# Altium schematic sheet CLK_DISTRO.SchDoc: Clock Generator, 500kHz, 4 Phase
size Letter; Organization: ORGANIZATION; Address1: ADDRESS 1; Address2: ADDRESS 2; Address3: ADDRESS 3; Address4: ADDRESS 4; Revision: -; SheetNumber: 1; SheetTotal: 1; ENG_APP_DATE: --/--/--; DSN_APP_DATE: --/--/--; CHK_APP_DATE: --/--/--
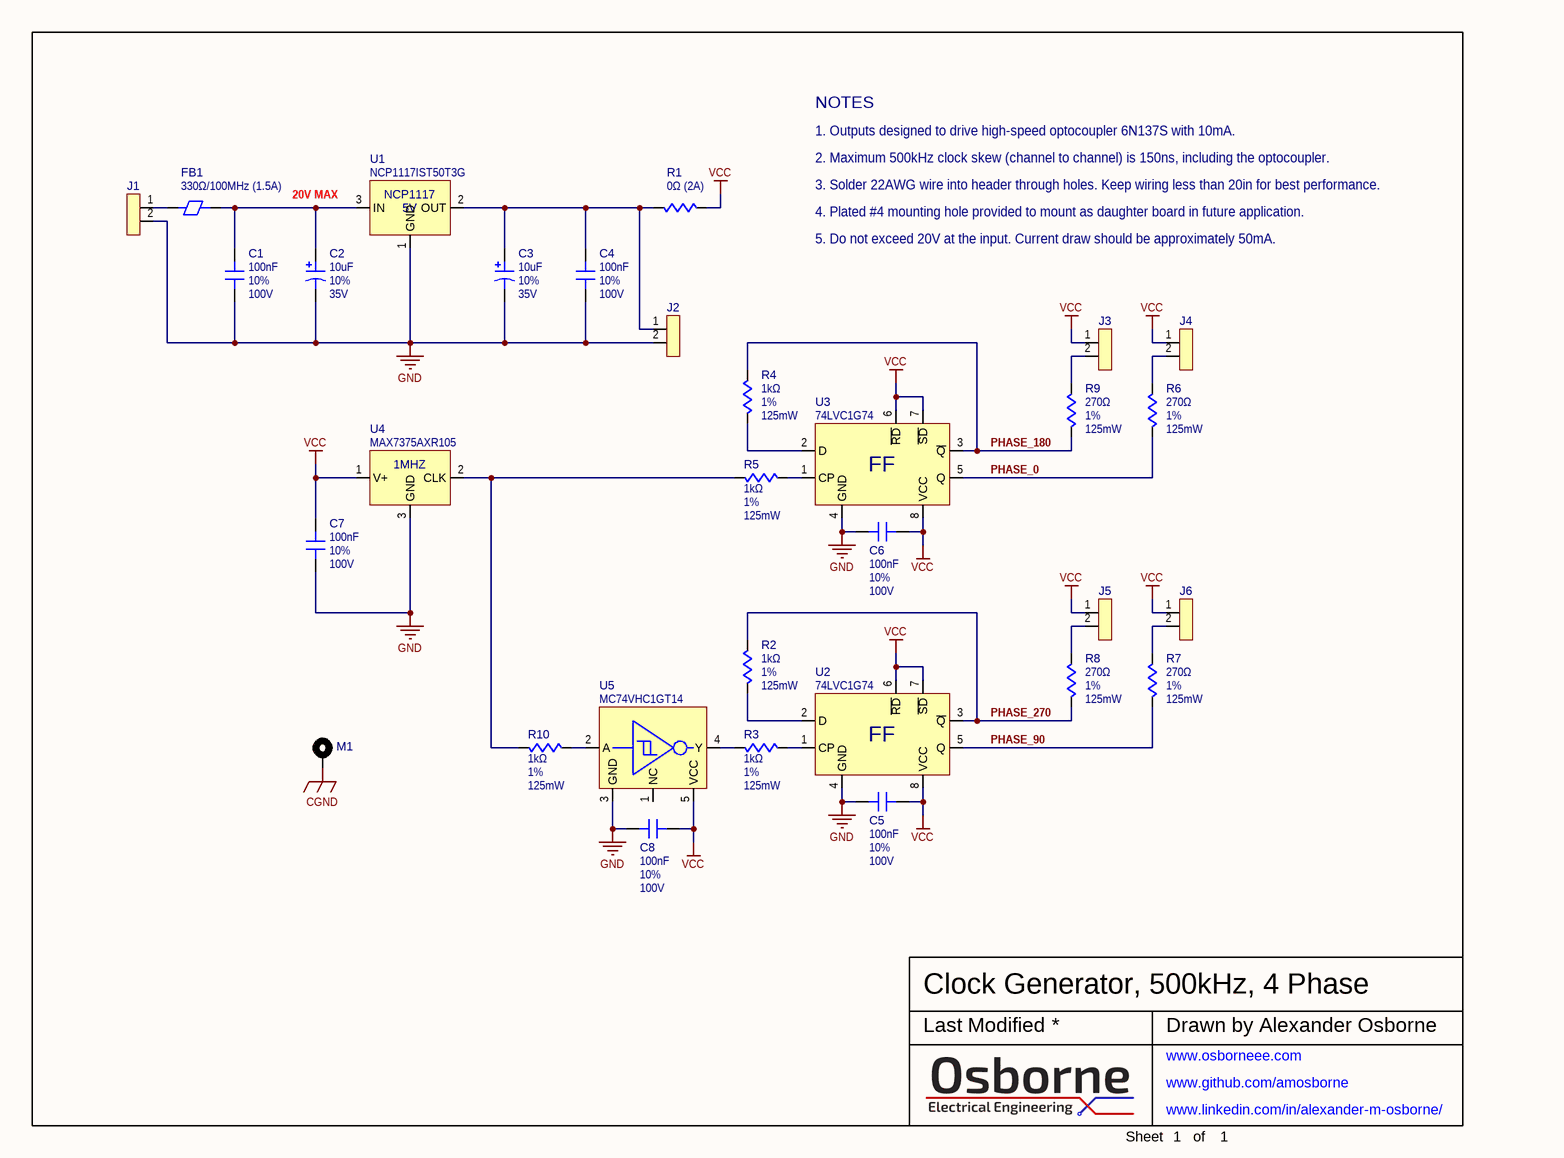
[diagram p0: CLK_DISTRO.SchDoc]

## Parts
C1  value 100nF  Voltage: 100V  Tolerance: 10%  [C0805]  (hidden comment: 732-12244-1-ND)
C2  value 10uF  Voltage: 35V  Tolerance: 10%  [TRJC]  (hidden comment: 478-7582-1-ND)
C3  value 10uF  Voltage: 35V  Tolerance: 10%  [TRJC]  (hidden comment: 478-7582-1-ND)
C4  value 100nF  Voltage: 100V  Tolerance: 10%  [C0805]  (hidden comment: 732-12244-1-ND)
C5  value 100nF  Voltage: 100V  Tolerance: 10%  [C0805]  (hidden comment: 732-12244-1-ND)
C6  value 100nF  Voltage: 100V  Tolerance: 10%  [C0805]  (hidden comment: 732-12244-1-ND)
C7  value 100nF  Voltage: 100V  Tolerance: 10%  [C0805]  (hidden comment: 732-12244-1-ND)
C8  value 100nF  Voltage: 100V  Tolerance: 10%  [C0805]  (hidden comment: 732-12244-1-ND)
FB1  value 330Ω/100MHz (1.5A)  [C0805]  (hidden comment: 553-2394-1-ND)
J1  (no value)  [Header_1x2]  (no BOM)
J2  (no value)  [Header_1x2]  (no BOM)
J3  (no value)  [Header_1x2]  (no BOM)
J4  (no value)  [Header_1x2]  (no BOM)
J5  (no value)  [Header_1x2]  (no BOM)
J6  (no value)  [Header_1x2]  (no BOM)
M1  (no value)  [MTG_HOLE_No4]  (no BOM)
R1  value 0Ω (2A)  [R0805]  (hidden comment: RMCF0805ZT0R00CT-ND)
R2  value 1kΩ  Tolerance: 1%  Power: 125mW  [R0805]  (hidden comment: RMCF0805FT1K00CT-ND)
R3  value 1kΩ  Tolerance: 1%  Power: 125mW  [R0805]  (hidden comment: RMCF0805FT1K00CT-ND)
R4  value 1kΩ  Tolerance: 1%  Power: 125mW  [R0805]  (hidden comment: RMCF0805FT1K00CT-ND)
R5  value 1kΩ  Tolerance: 1%  Power: 125mW  [R0805]  (hidden comment: RMCF0805FT1K00CT-ND)
R6  value 270Ω  Tolerance: 1%  Power: 125mW  [R0805]  (hidden comment: RMCF0805FT270RCT-ND)
R7  value 270Ω  Tolerance: 1%  Power: 125mW  [R0805]  (hidden comment: RMCF0805FT270RCT-ND)
R8  value 270Ω  Tolerance: 1%  Power: 125mW  [R0805]  (hidden comment: RMCF0805FT270RCT-ND)
R9  value 270Ω  Tolerance: 1%  Power: 125mW  [R0805]  (hidden comment: RMCF0805FT270RCT-ND)
R10  value 1kΩ  Tolerance: 1%  Power: 125mW  [R0805]  (hidden comment: RMCF0805FT1K00CT-ND)
U1  NCP1117IST50T3G  [SOT223]
U2  74LVC1G74  [TSSOP-8]
U3  74LVC1G74  [TSSOP-8]
U4  MAX7375AXR105  [SC70]
U5  MC74VHC1GT14  [TSOP-5]

## Nets
CGND: M1.1
GND: C1.2 C2.2 C3.2 C4.2 C5.2 C6.2 C7.2 C8.2 J1.2 J2.2 U1.1(GND) U2.4(GND) U3.4(GND) U4.3(GND) U5.3(GND)
VCC: C5.1 C6.1 C7.1 C8.1 J3.1 J4.1 J5.1 J6.1 R1.2 U2.6(~{RD}) U2.7(~{SD}) U2.8(VCC) U3.6(~{RD}) U3.7(~{SD}) U3.8(VCC) U4.1(V+) U5.5(VCC)
PHASE_0: R6.2 U3.5(Q)
PHASE_90: R7.2 U2.5(Q)
PHASE_180: R4.2 R9.2 U3.3(~{Q})
PHASE_270: R2.2 R8.2 U2.3(~{Q})
NetC1_1: C1.1 C2.1 FB1.2 U1.3(IN)
NetC3_1: C3.1 C4.1 J2.1 R1.1 U1.2(OUT)
NetFB1_1: FB1.1 J1.1
NetJ3_2: J3.2 R9.1
NetJ4_2: J4.2 R6.1
NetJ5_2: J5.2 R8.1
NetJ6_2: J6.2 R7.1
NetR2_1: R2.1 U2.2(D)
NetR3_1: R3.1 U5.4(Y)
NetR3_2: R3.2 U2.1(CP)
NetR4_1: R4.1 U3.2(D)
NetR5_1: R5.1 R10.1 U4.2(CLK)
NetR5_2: R5.2 U3.1(CP)
NetR10_2: R10.2 U5.2(A)

Not connected (* = marked no-connect by the designer): U5 1(NC)

## Notes on the sheet
- NOTES
- 1. Outputs designed to drive high-speed optocoupler 6N137S with 10mA.
- 2. Maximum 500kHz clock skew (channel to channel) is 150ns, including the optocoupler.
- (near U1) 20V MAX
- 3. Solder 22AWG wire into header through holes. Keep wiring less than 20in for best performance.
- 4. Plated #4 mounting hole provided to mount as daughter board in future application.
- 5. Do not exceed 20V at the input. Current draw should be approximately 50mA.
- Last Modified
- Drawn by Alexander Osborne
- www.osborneee.com <http://www.osborneee.com>
- www.github.com/amosborne <http://www.github.com/amosborne>
- Sheet
- www.linkedin.com/in/alexander-m-osborne/ <http://www.linkedin.com/in/alexander-m-osborne/>
- of
- (in symbol 74LVC1G74) FF
- (in symbol MAX7375AXR105) 1MHZ
- (in symbol NCP1117IST50T3G) NCP1117; 5V

## Library data of the parts
C1 C4-C8 = CAP-CER-100N-10T-100V-0805: CAP, CER, 100nF ±10%, 100V, 0805; Supplier 1: Digi-Key; Supplier Part Number 1: 732-12244-1-ND
C2 C3 = CAP-TANT-10U-10T-35V-2312: CAP, TANT, 10uF ±10%, 35V, 2312; Supplier 1: Digi-Key; Supplier Part Number 1: 478-7582-1-ND
FB1 = BEAD-330R-1A5-0805: BEAD, 330Ω/100MHz, 1.5A, 0805; Supplier 1: Digi-Key; Supplier Part Number 1: 553-2394-1-ND
J1-J6 = HEADER_1x2: Header 1x2 THT
M1 = MTG_HOLE: Mounting Hole
R1 = RES-JUMP-2A-0805: RES, JUMP, 0Ω, 2A, 0805; Supplier 1: Digi-Key; Supplier Part Number 1: RMCF0805ZT0R00CT-ND
R2-R5 R10 = RES-1K00-1T00-W125-0805: RES, 1.00kΩ ±1.00%, 125mW, 0805; Supplier 1: Digi-Key; Supplier Part Number 1: RMCF0805FT1K00CT-ND
R6-R9 = RES-270R-1T00-W125-0805: RES, 270Ω ±1.00%, 125mW, 0805; Supplier 1: Digi-Key; Supplier Part Number 1: RMCF0805FT270RCT-ND
U1 = NCP1117IST50T3G: Low-Dropout Regulator, 5V, 1A; Supplier 1: Digi-Key; Supplier Part Number 1: 488-NCP1117IST50T3GCT-ND
U2 U3 = 74LVC1G74: D-Type Flip-Flop, TTL; Supplier 1: Digi-Key; Supplier Part Number 1: 1727-7463-1-ND
U4 = MAX7375AXR105: OSC, 1MHz, CMOS; Supplier 1: Digi-Key; Supplier Part Number 1: MAX7375AXR105+TCT-ND
U5 = MC74VHC1GT14: Schmitt Trigger Inverter, TTL; Supplier 1: Digi-Key; Supplier Part Number 1: M74VHC1GT14DTT1GOSCT-ND